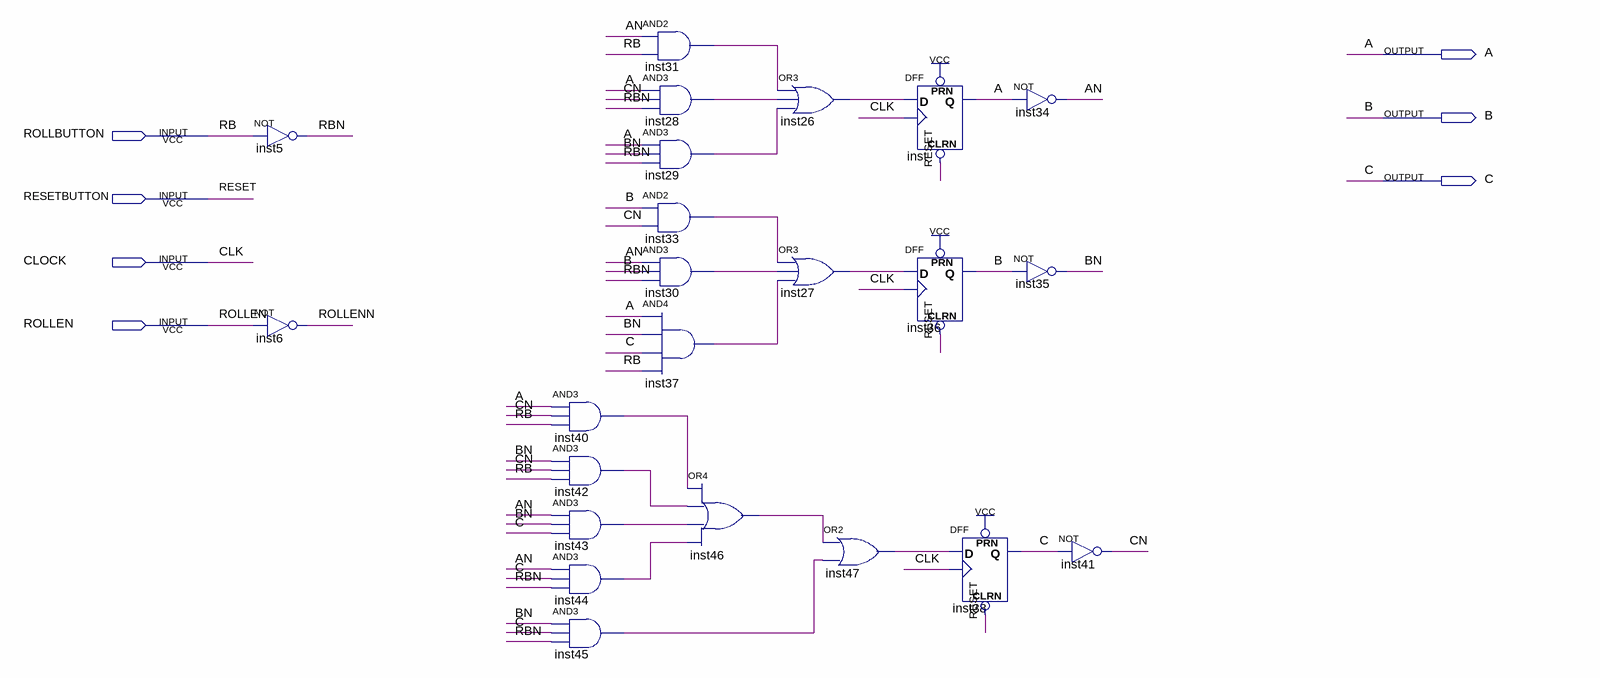
[diagram p0: schematic sheet]
// Quartus schematic DieCounter.bdf as structural Verilog: 23 symbols, 7 pins
module DieCounter (
  input  ROLLBUTTON,
  input  RESETBUTTON,
  input  CLOCK,
  input  ROLLEN,
  output A,
  output B,
  output C
);

  wire AN, BN, CN, inst26_out, inst27_out, inst28_out, inst29_out, inst30_out, inst31_out, inst33_out,
       inst37_out, inst40_out, inst42_out, inst43_out, inst44_out, inst45_out, inst46_out, inst47_out, RBN,
       ROLLENN;

  not inst5 (RBN, ROLLBUTTON);
  not inst6 (ROLLENN, ROLLEN);
  and inst40 (inst40_out, A, CN, ROLLBUTTON);
  and inst42 (inst42_out, BN, CN, ROLLBUTTON);
  and inst43 (inst43_out, AN, BN, C);
  and inst44 (inst44_out, AN, C, RBN);
  and inst45 (inst45_out, BN, C, RBN);
  and inst31 (inst31_out, AN, ROLLBUTTON);
  and inst28 (inst28_out, A, CN, RBN);
  and inst29 (inst29_out, A, BN, RBN);
  and inst33 (inst33_out, B, CN);
  and inst30 (inst30_out, AN, B, RBN);
  and inst37 (inst37_out, A, BN, C, ROLLBUTTON);
  or inst46 (inst46_out, inst40_out, inst42_out, inst43_out, inst44_out);
  or inst26 (inst26_out, inst31_out, inst28_out, inst29_out);
  or inst27 (inst27_out, inst33_out, inst30_out, inst37_out);
  or inst47 (inst47_out, inst46_out, inst45_out);
  DFF inst (.CLRN(RESETBUTTON), .CLK(CLOCK), .D(inst26_out), .PRN(1'b1), .Q(A));
  DFF inst36 (.CLRN(RESETBUTTON), .CLK(CLOCK), .D(inst27_out), .PRN(1'b1), .Q(B));
  DFF inst38 (.CLRN(RESETBUTTON), .CLK(CLOCK), .D(inst47_out), .PRN(1'b1), .Q(C));
  not inst34 (AN, A);
  not inst35 (BN, B);
  not inst41 (CN, C);

  // Other names for the same wires on the sheet: CLK = CLOCK; RB = ROLLBUTTON; RESET = RESETBUTTON
endmodule
